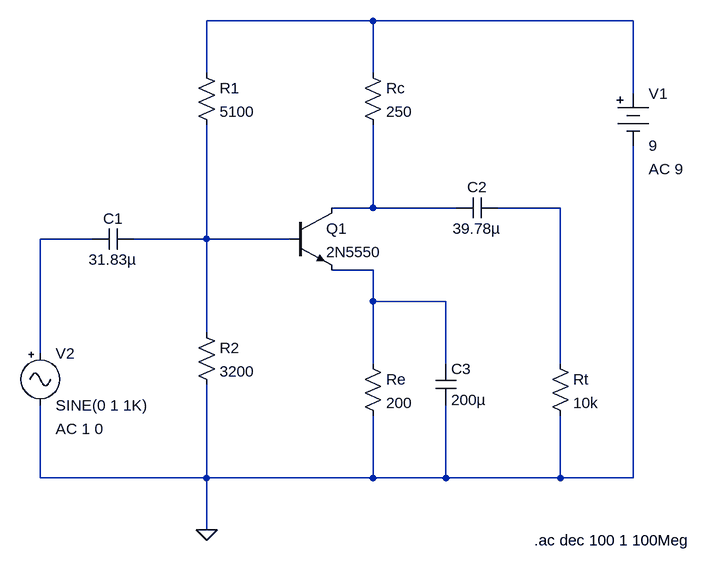
[diagram p0: schematic Shema pojacala.asc]
Shema pojacala.asc, the LTspice schematic file:
Version 4
SHEET 1 1076 708
WIRE 240 -112 -16 -112
WIRE 640 -112 240 -112
WIRE -16 -32 -16 -112
WIRE 240 -32 240 -112
WIRE 640 0 640 -112
WIRE 240 176 240 48
WIRE 240 176 176 176
WIRE 368 176 240 176
WIRE 528 176 432 176
WIRE -192 224 -272 224
WIRE -16 224 -16 48
WIRE -16 224 -128 224
WIRE 112 224 -16 224
WIRE 240 272 176 272
WIRE 240 320 240 272
WIRE 352 320 240 320
WIRE -16 368 -16 224
WIRE -272 400 -272 224
WIRE 240 416 240 320
WIRE 352 416 352 320
WIRE 528 416 528 176
WIRE -272 592 -272 480
WIRE -16 592 -16 448
WIRE -16 592 -272 592
WIRE 240 592 240 496
WIRE 240 592 -16 592
WIRE 352 592 352 480
WIRE 352 592 240 592
WIRE 528 592 528 496
WIRE 528 592 352 592
WIRE 640 592 640 80
WIRE 640 592 528 592
WIRE -16 672 -16 592
FLAG -16 672 0
SYMBOL res 224 -48 R0
SYMATTR InstName Rc
SYMATTR Value 250
SYMBOL res 224 400 R0
SYMATTR InstName Re
SYMATTR Value 200
SYMBOL res -32 -48 R0
SYMATTR InstName R1
SYMATTR Value 5100
SYMBOL res -32 352 R0
SYMATTR InstName R2
SYMATTR Value 3200
SYMBOL res 512 400 R0
SYMATTR InstName Rt
SYMATTR Value 10k
SYMBOL cap 336 416 R0
SYMATTR InstName C3
SYMATTR Value 200µ
SYMBOL cap 368 192 R270
WINDOW 0 32 32 VTop 2
WINDOW 3 0 32 VBottom 2
SYMATTR InstName C2
SYMATTR Value 39.78µ
SYMBOL cap -128 208 R90
WINDOW 0 0 32 VBottom 2
WINDOW 3 32 32 VTop 2
SYMATTR InstName C1
SYMATTR Value 31.83µ
SYMBOL npn 112 176 R0
SYMATTR InstName Q1
SYMATTR Value 2N5550
SYMBOL Misc\\signal -272 384 R0
WINDOW 123 24 132 Left 2
WINDOW 39 0 0 Left 0
SYMATTR InstName V2
SYMATTR Value2 AC 1 0
SYMBOL Misc\\battery 640 -16 R0
WINDOW 123 24 132 Left 2
WINDOW 39 0 0 Left 0
SYMATTR InstName V1
SYMATTR Value 9
SYMATTR Value2 AC 9
TEXT 488 688 Left 2 !.ac dec 100 1 100Meg

The netlist it stands for:
* Shema pojacala.asc
Rc N001 N002 250
Re N006 0 200
R1 N001 N005 5100
R2 N005 0 3200
Rt N003 0 10k
C3 N006 0 200µ
C2 N002 N003 39.78µ
C1 N005 N004 31.83µ
Q1 N002 N005 N006 0 2N5550
V2 N004 0 SINE(0 1 1K) AC 1 0
V1 N001 0 9 AC 9
.model NPN NPN
.model PNP PNP
.lib standard.bjt
.ac dec 100 1 100Meg
.backanno
.end